# Altium schematic sheet SCH_04_Chest_Lead_Amplifier.SchDoc
size A4; SheetNumber: 9; SheetTotal: 14; SPICEModelCacheUCDMULDR: <root> / <DocumentId>UCDMULDR</DocumentId> / <CacheFrame Number="0"> / <Model Name="0603_885012206095_100nf" Kind="CKT"> / <Text>******* / .subckt 0603_885012206095_100nF 1 2 / Rser 1 3 0.0157659152881 / Lser 2 4 3.10171966E-10 / C1 3 4 0.0000001 / Rpar 3 4 5000000000 / .ends 0603_885012206095_100nF</Text> / </Model> / </CacheFrame> / </root>
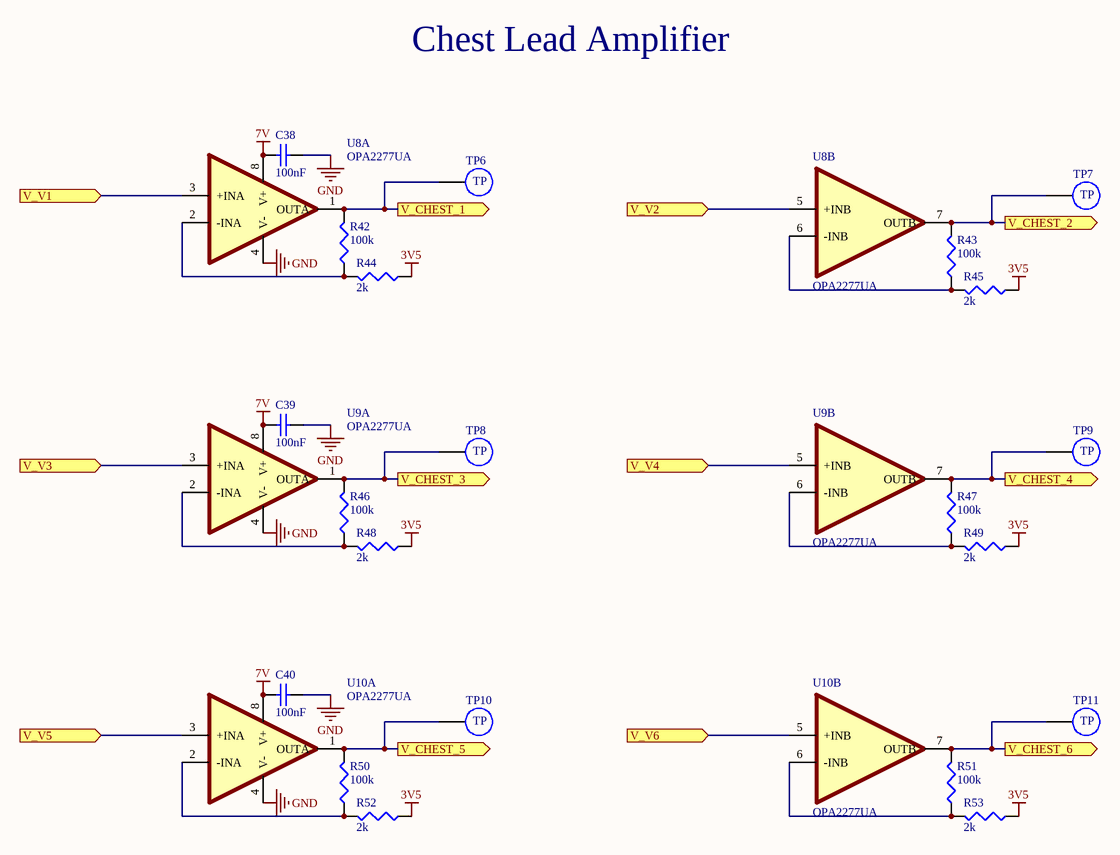
[diagram p0: SCH_04_Chest_Lead_Amplifier.SchDoc]

## Parts
C38  100nF  [WCAP-CSGP_0603_L1.6W0.8H0.8_Reflow]
C39  100nF  [WCAP-CSGP_0603_L1.6W0.8H0.8_Reflow]
C40  100nF  [WCAP-CSGP_0603_L1.6W0.8H0.8_Reflow]
R42  100k  [WRIS-PSMB_0603_L1.6W0.8H0.35]
R43  100k  [WRIS-PSMB_0603_L1.6W0.8H0.35]
R44  2k  [WRIS-PSMB_0603_L1.6W0.8H0.35]
R45  2k  [WRIS-PSMB_0603_L1.6W0.8H0.35]
R46  100k  [WRIS-PSMB_0603_L1.6W0.8H0.35]
R47  100k  [WRIS-PSMB_0603_L1.6W0.8H0.35]
R48  2k  [WRIS-PSMB_0603_L1.6W0.8H0.35]
R49  2k  [WRIS-PSMB_0603_L1.6W0.8H0.35]
R50  100k  [WRIS-PSMB_0603_L1.6W0.8H0.35]
R51  100k  [WRIS-PSMB_0603_L1.6W0.8H0.35]
R52  2k  [WRIS-PSMB_0603_L1.6W0.8H0.35]
R53  2k  [WRIS-PSMB_0603_L1.6W0.8H0.35]
TP6  Pad_Test_Point  [Pad_Test_Point]  (value not drawn)
TP7  Pad_Test_Point  [Pad_Test_Point]  (value not drawn)
TP8  Pad_Test_Point  [Pad_Test_Point]  (value not drawn)
TP9  Pad_Test_Point  [Pad_Test_Point]  (value not drawn)
TP10  Pad_Test_Point  [Pad_Test_Point]  (value not drawn)
TP11  Pad_Test_Point  [Pad_Test_Point]  (value not drawn)
U8  OPA2277UA  [SOIC127P599X175-8N]  (parts A,B of 2)
U9  OPA2277UA  [SOIC127P599X175-8N]  (parts A,B of 2)
U10  OPA2277UA  [SOIC127P599X175-8N]  (parts A,B of 2)

## Ports
V_CHEST_1 (out, see Schematic_Top[2C], SCH_06_Analog_Mux[2C]), V_CHEST_2 (out, see Schematic_Top[2C], SCH_06_Analog_Mux[2C]), V_CHEST_3 (out, see Schematic_Top[2C], SCH_06_Analog_Mux[2C]), V_CHEST_4 (out, see Schematic_Top[2C], SCH_06_Analog_Mux[2C]), V_CHEST_5 (out, see Schematic_Top[2C], SCH_06_Analog_Mux[2C]), V_CHEST_6 (out, see Schematic_Top[2C], SCH_06_Analog_Mux[2D]), V_V1 (in, see Schematic_Top[1C], SCH_02_Electrodes[4A]), V_V2 (in, see Schematic_Top[1C], SCH_02_Electrodes[4A]), V_V3 (in, see Schematic_Top[1C], SCH_02_Electrodes[4B]), V_V4 (in, see Schematic_Top[1C], SCH_02_Electrodes[4C]), V_V5 (in, see Schematic_Top[1C], SCH_02_Electrodes[4C]), V_V6 (in, see Schematic_Top[1C], SCH_02_Electrodes[4D])

## Nets
3V5: R44.1 R45.1 R48.1 R49.1 R52.1 R53.1
7V: C38.2 C39.2 C40.2 U8.8(V+) U9.8(V+) U10.8(V+)
GND: C38.1 C39.1 C40.1 U8.4(V-) U9.4(V-) U10.4(V-)
V_CHEST_1: R42.2 TP6.1 U8.1(OUTA) ; port V_CHEST_1
V_CHEST_2: R43.2 TP7.1 U8.7(OUTB) ; port V_CHEST_2
V_CHEST_3: R46.2 TP8.1 U9.1(OUTA) ; port V_CHEST_3
V_CHEST_4: R47.2 TP9.1 U9.7(OUTB) ; port V_CHEST_4
V_CHEST_5: R50.2 TP10.1 U10.1(OUTA) ; port V_CHEST_5
V_CHEST_6: R51.2 TP11.1 U10.7(OUTB) ; port V_CHEST_6
V_V1: U8.3(+INA) ; port V_V1
V_V2: U8.5(+INB) ; port V_V2
V_V3: U9.3(+INA) ; port V_V3
V_V4: U9.5(+INB) ; port V_V4
V_V5: U10.3(+INA) ; port V_V5
V_V6: U10.5(+INB) ; port V_V6
NetR42_1: R42.1 R44.2 U8.2(-INA)
NetR43_1: R43.1 R45.2 U8.6(-INB)
NetR46_1: R46.1 R48.2 U9.2(-INA)
NetR47_1: R47.1 R49.2 U9.6(-INB)
NetR50_1: R50.1 R52.2 U10.2(-INA)
NetR51_1: R51.1 R53.2 U10.6(-INB)

## Notes on the sheet
- Chest Lead Amplifier
- Title:
- Date:
- Time:
- Drawn by:
- Phung Nhat Minh
- Sheet
- of
- (in symbol Pad_Test_Point) TP

## Library data of the parts
C38-C40 = 885012206095: WCAP-CSGP Multilayer Ceramic Chip Capacitor, General Purpose, size 0603, X7R, 100nF, 50VDC; Manufacturer: Wurth Elektronik; Case/Size Code: 0603; Capacitance Tolerance: +/-10%; Dissipation Factor: 3%; Insulation Resistance: 5GOhm; Rated Voltage (DC): 50V; Technical Reference: X7R0603104K050DFCT10000; Manufacturer Part Number: 885012206095; Category: Multilayer Ceramic Chip Capacitors; Match Code: WCAP-CSGP; ComponentLink1Description: Website Link; ComponentLink1URL: https://www.we-online.com/redexpert/article/885012206095?ad; ComponentLink2Description: Datasheet Link; ComponentLink2URL: https://www.we-online.com/redexpert/spec/885012206095?ad; Mount: Surface Mount; Operating Temperature Max: 125°C; Operating Temperature Min: -55°C; Packaging: Tape and Reel; Length: 1.6mm; Width: 0.8mm; Height: 0.8mm; Capacitance: 100nF; Ceramic Type: X7R
R42-R53 = 580060716001: WRIS-PSMB Metal Plate Resistor, SMT, size 0603, 0.33W, 5mΩ, +/-1%; Manufacturer: Wurth Elektronik; Case/Size Code: 0603; Rated Current: 8.12A; Technical Reference: MB0603R005F103KAATP0000; Temperature Coefficient of Resistance: +/-100ppm/°C; Manufacturer Part Number: 580060716001; Category: Metal Plate Resistors; Match Code: WRIS-PSMB; ComponentLink1Description: Website Link; ComponentLink1URL: https://www.we-online.com/redexpert/article/580060716001?ad; ComponentLink2Description: Datasheet Link; ComponentLink2URL: https://www.we-online.com/redexpert/spec/580060716001?ad; Mount: Surface Mount; Operating Temperature Max: 155°C; Operating Temperature Min: -55°C; Packaging: Tape and Reel; Length: 1.6mm; Width: 0.8mm; Height: 0.35mm; Rated Power: 0.33W; Resistance: 5mΩ; Resistance Tolerance: +/-1%
U8-U10 = OPA2277UA: MP: OPA2227UA; Package: None; Price: None; Value: *; Availability: Unavailable